# EAGLE schematic megamini-R32 (EAGLE 6.2)
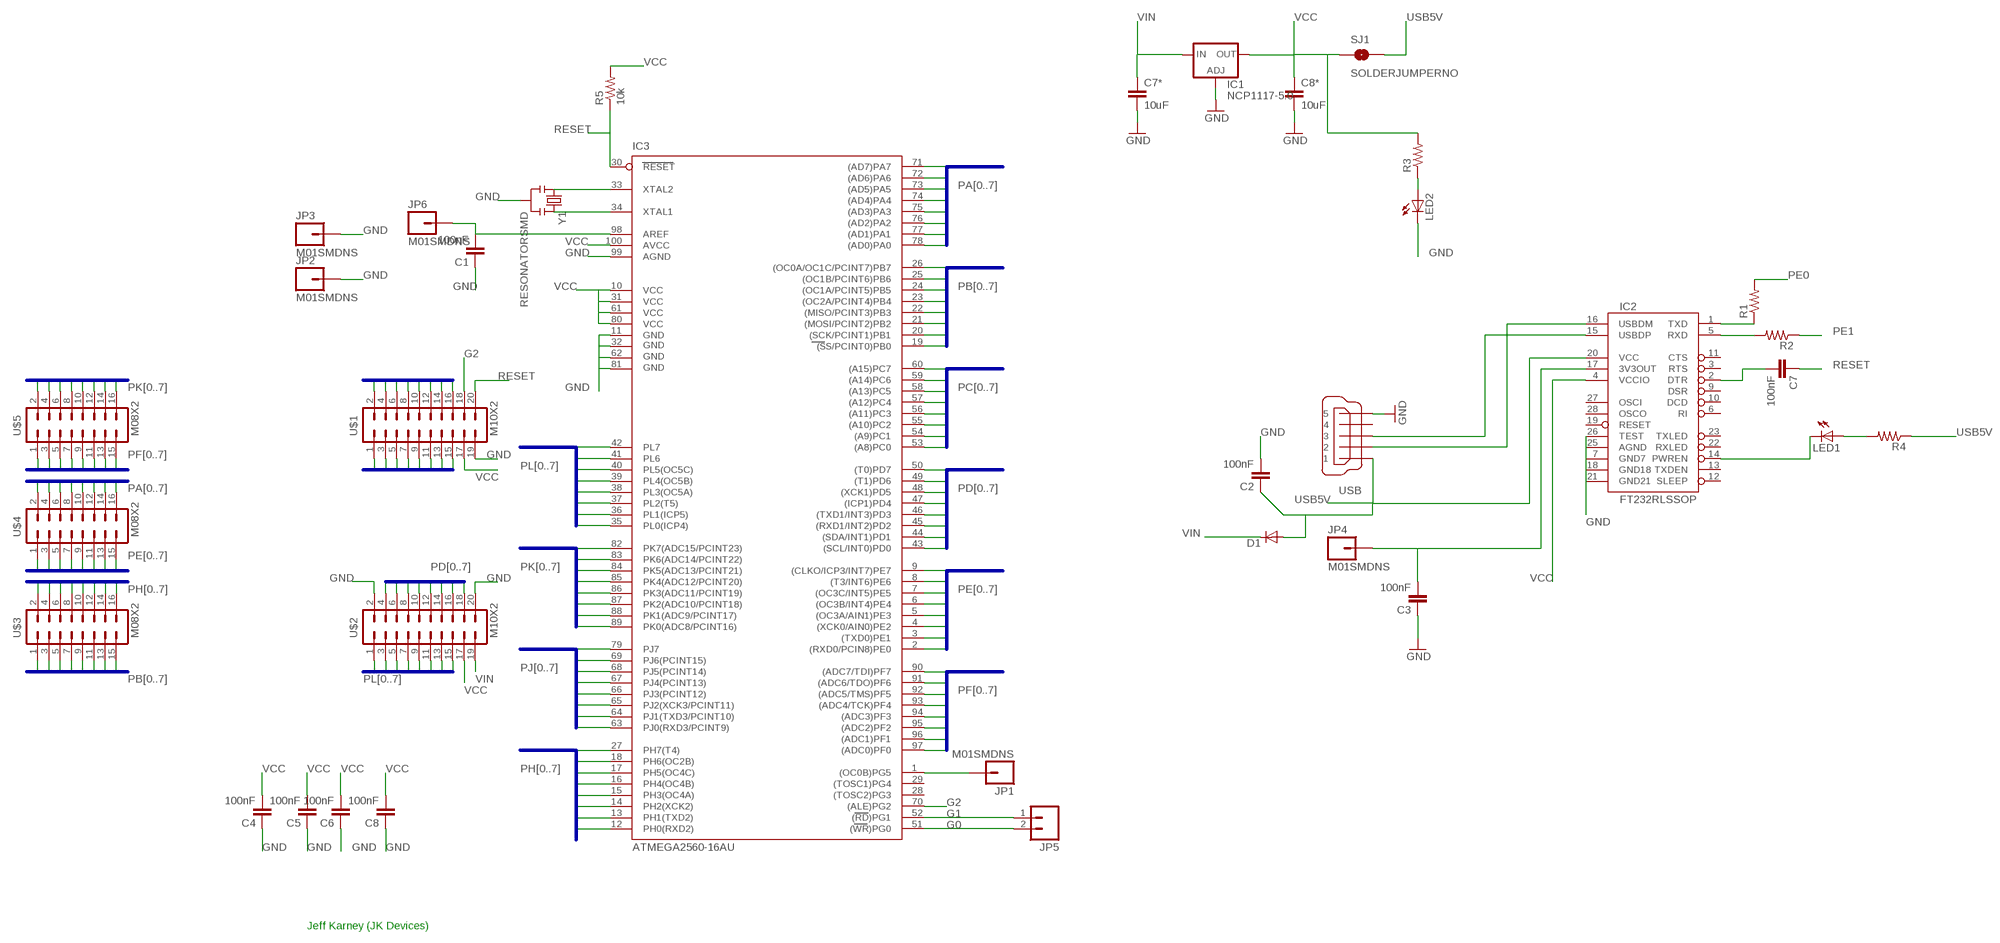
[diagram p0: schematic, sheet 1]

## Parts
C1  100nF  CAP0805  [0805]
C2  100nF  CAP0805  [0805]
C3  100nF  CAP0805  [0805]
C4  100nF  CAP0805  [0805]
C5  100nF  CAP0805  [0805]
C6  100nF  CAP0805  [0805]
C7  100nF  CAP0805  [0805]
C7*  10uF  CAP0805  [0805]
C8  100nF  CAP0805  [0805]
C8*  10uF  CAP0805  [0805]
D1  DIODESOD  [SOD-323]
IC1  NCP1117-5.0  LM317MDT  [DPACK]
IC2  FT232RLSSOP  [SSOP28DB]
IC3  ATMEGA2560-16AU  ATMEGA1280-16AU  [TQFP100]
JP1  M01SMDNS  [1X01NS]
JP2  M01SMDNS  [1X01NS]
JP3  M01SMDNS  [1X01NS]
JP4  M01SMDNS  [1X01NS]
JP5  M02PTH  [1X02]
JP6  M01SMDNS  [1X01NS]
LED1  LED0603  [LED-0603]
LED2  LED0603  [LED-0603]
R1  RESISTOR0805-RES  [0805]
R2  RESISTOR0805-RES  [0805]
R3  RESISTOR0805-RES  [0805]
R4  RESISTOR0805-RES  [0805]
R5  10k  RESISTOR0805-RES  [0805]
SJ1  SOLDERJUMPERNO  [SJ_2S-NO]
U$1  M10X2  [2X10]
U$2  M10X2  [2X10]
U$3  M08X2  [2X8_SMALL]
U$4  M08X2  [2X8_SMALL]
U$5  M08X2  [2X8_SMALL]
USB  MINI-USB-UX60-MB-5ST  [UX60-MB-5ST]
Y1  RESONATORSMD  [RESONATOR-SMD]

## Nets
G0: IC3.51((WR)PG0) JP5.2
G1: IC3.52((RD)PG1) JP5.1
G2: IC3.70((ALE)PG2) U$1.18
GND: C1.1 C2.2 C3.1 C4.1 C5.1 C6.1 C7*.2 C8*.2 C8.1 IC1.1(ADJ) IC2.7(GND7) IC2.18(GND18) IC2.21(GND21) IC2.25(AGND) IC2.26(TEST) IC3.11(GND) IC3.32(GND1) IC3.62(GND2) IC3.81(GND3) IC3.99(AGND) JP2.1 JP3.1 LED2.C U$1.19 U$2.2 U$2.20 USB.5 Y1.2
N$1: IC2.16(USBDM) USB.2
N$2: IC3.1((OC0B)PG5) JP1.1
N$3: IC2.15(USBDP) USB.3
N$4: C7.2 IC2.2(DTR)
N$5: IC2.1(TXD) R1.1
N$6: IC2.5(RXD) R2.2
N$7: C3.2 IC2.17(3V3OUT) JP4.1
N$8: IC3.33(XTAL2) Y1.1
N$9: IC3.34(XTAL1) Y1.3
N$10: LED2.A R3.1
N$11: LED1.A R4.2
N$12: IC2.14(PWREN) LED1.C
N$13: C1.2 IC3.98(AREF) JP6.1
PA0: IC3.78((AD0)PA0) U$4.2
PA1: IC3.77((AD1)PA1) U$4.4
PA2: IC3.76((AD2)PA2) U$4.6
PA3: IC3.75((AD3)PA3) U$4.8
PA4: IC3.74((AD4)PA4) U$4.10
PA5: IC3.73((AD5)PA5) U$4.12
PA6: IC3.72((AD6)PA6) U$4.14
PA7: IC3.71((AD7)PA7) U$4.16
PB0: IC3.19((SS/PCINT0)PB0) U$3.15
PB1: IC3.20((SCK/PCINT1)PB1) U$3.13
PB2: IC3.21((MOSI/PCINT2)PB2) U$3.11
PB3: IC3.22((MISO/PCINT3)PB3) U$3.9
PB4: IC3.23((OC2A/PCINT4)PB4) U$3.7
PB5: IC3.24((OC1A/PCINT5)PB5) U$3.5
PB6: IC3.25((OC1B/PCINT6)PB6) U$3.3
PB7: IC3.26((OC0A/OC1C/PCINT7)PB7) U$3.1
PC0: IC3.53((A8)PC0) U$1.15
PC1: IC3.54((A9)PC1) U$1.13
PC2: IC3.55((A10)PC2) U$1.11
PC3: IC3.56((A11)PC3) U$1.9
PC4: IC3.57((A12)PC4) U$1.7
PC5: IC3.58((A13)PC5) U$1.5
PC6: IC3.59((A14)PC6) U$1.3
PC7: IC3.60((A15)PC7) U$1.1
PD0: IC3.43((SCL/INT0)PD0) U$2.4
PD1: IC3.44((SDA/INT1)PD1) U$2.6
PD2: IC3.45((RXD1/INT2)PD2) U$2.8
PD3: IC3.46((TXD1/INT3)PD3) U$2.10
PD4: IC3.47((ICP1)PD4) U$2.12
PD5: IC3.48((XCK1)PD5) U$2.14
PD6: IC3.49((T1)PD6) U$2.16
PD7: IC3.50((T0)PD7) U$2.18
PE0: IC3.2((RXD0/PCIN8)PE0) R1.2 U$4.15
PE1: IC3.3((TXD0)PE1) R2.1 U$4.13
PE2: IC3.4((XCK0/AIN0)PE2) U$4.11
PE3: IC3.5((OC3A/AIN1)PE3) U$4.9
PE4: IC3.6((OC3B/INT4)PE4) U$4.7
PE5: IC3.7((OC3C/INT5)PE5) U$4.5
PE6: IC3.8((T3/INT6)PE6) U$4.3
PE7: IC3.9((CLKO/ICP3/INT7)PE7) U$4.1
PF0: IC3.97((ADC0)PF0) U$5.15
PF1: IC3.96((ADC1)PF1) U$5.13
PF2: IC3.95((ADC2)PF2) U$5.11
PF3: IC3.94((ADC3)PF3) U$5.9
PF4: IC3.93((ADC4/TCK)PF4) U$5.7
PF5: IC3.92((ADC5/TMS)PF5) U$5.5
PF6: IC3.91((ADC6/TDO)PF6) U$5.3
PF7: IC3.90((ADC7/TDI)PF7) U$5.1
PH0: IC3.12(PH0(RXD2)) U$3.16
PH1: IC3.13(PH1(TXD2)) U$3.14
PH2: IC3.14(PH2(XCK2)) U$3.12
PH3: IC3.15(PH3(OC4A)) U$3.10
PH4: IC3.16(PH4(OC4B)) U$3.8
PH5: IC3.17(PH5(OC4C)) U$3.6
PH6: IC3.18(PH6(OC2B)) U$3.4
PH7: IC3.27(PH7(T4)) U$3.2
PJ0: IC3.63(PJ0(RXD3/PCINT9)) U$1.2
PJ1: IC3.64(PJ1(TXD3/PCINT10)) U$1.4
PJ2: IC3.65(PJ2(XCK3/PCINT11)) U$1.6
PJ3: IC3.66(PJ3(PCINT12)) U$1.8
PJ4: IC3.67(PJ4(PCINT13)) U$1.10
PJ5: IC3.68(PJ5(PCINT14)) U$1.12
PJ6: IC3.69(PJ6(PCINT15)) U$1.14
PJ7: IC3.79(PJ7) U$1.16
PK0: IC3.89(PK0(ADC8/PCINT16)) U$5.16
PK1: IC3.88(PK1(ADC9/PCINT17)) U$5.14
PK2: IC3.87(PK2(ADC10/PCINT18)) U$5.12
PK3: IC3.86(PK3(ADC11/PCINT19)) U$5.10
PK4: IC3.85(PK4(ADC12/PCINT20)) U$5.8
PK5: IC3.84(PK5(ADC13/PCINT21)) U$5.6
PK6: IC3.83(PK6(ADC14/PCINT22)) U$5.4
PK7: IC3.82(PK7(ADC15/PCINT23)) U$5.2
PL0: IC3.35(PL0(ICP4)) U$2.1
PL1: IC3.36(PL1(ICP5)) U$2.3
PL2: IC3.37(PL2(T5)) U$2.5
PL3: IC3.38(PL3(OC5A)) U$2.7
PL4: IC3.39(PL4(OC5B)) U$2.9
PL5: IC3.40(PL5(OC5C)) U$2.11
PL6: IC3.41(PL6) U$2.13
PL7: IC3.42(PL7) U$2.15
RESET: C7.1 IC3.30(RESET) R5.1 U$1.20
USB5V: C2.1 D1.2(A) IC2.20(VCC) R4.1 SJ1.2 USB.1
VCC: C4.2 C5.2 C6.2 C8*.1 C8.2 IC1.4(OUT) IC2.4(VCCIO) IC3.10(VCC) IC3.31(VCC1) IC3.61(VCC2) IC3.80(VCC3) IC3.100(AVCC) R3.2 R5.2 SJ1.1 U$1.17 U$2.17
VIN: C7*.1 D1.1(C) IC1.3(IN) U$2.19
Unconnected: IC2.3(RTS) IC2.6(RI) IC2.9(DSR) IC2.10(DCD) IC2.11(CTS) IC2.12(SLEEP) IC2.13(TXDEN) IC2.19(RESET) IC2.22(RXLED) IC2.23(TXLED) IC2.27(OSCI) IC2.28(OSCO) IC3.28((TOSC2)PG3) IC3.29((TOSC1)PG4) USB.4

## Buses
PB[0..7]
PH[0..7]
PE[0..7]
PA[0..7]
PF[0..7]
PK[0..7]
PL[0..7]
PD[0..7]
PC[0..7]
PJ[0..7]

## Notes on the sheet
- Jeff Karney (JK Devices)

## Library data of the parts
C1-C7 C7* C8 C8* = SparkFun:CAP: Capacitor Standard 0603 ceramic capacitor, and 0.1" leaded capacitor.
D1 = SparkFun:DIODE: Diode These are standard reverse protection diodes and small signal diodes. SMA package can handle up to about 1A. SOD-323 can handle about 200mA. What the SOD-323 package when ordering, there are some mfgs out there that are 5-pin packages.
IC1 = v-reg:LM317?*: 500 mA Adjustable Output Positive Voltage Regulator Source: http://www.onsemi.co.jp .. LM317M-D.PDF
IC2 = SparkFun:FT232RL: USB UART FT232RL 4th Generation USB UART (USB <-> Serial) Controller. Spark Fun Electronics SKU : COM-00650
IC3 = atmel-2005:ATMEGA*: MICROCONTROLLER 64/128/256 Kbytes FLASH 4 Kbytes EEPROM 8 Kbytes SRAM 86 General Purpose I/O pins 12-channels16-bit PWM 4 x Serial USARTs 16-channels 10-bit A/D
JP1-JP4 JP6 = SparkFun:M01: Header 1 Standard 1-pin 0.1" header. Use with straight break away headers (SKU : PRT-00116), right angle break away headers (PRT-00553), swiss pins (PRT-00743), machine pins (PRT-00117), and female headers (PRT-00115).
JP5 = SparkFun:M02: Header 2 Standard 2-pin 0.1" header. Use with straight break away headers (SKU : PRT-00116), right angle break away headers (PRT-00553), swiss pins (PRT-00743), machine pins (PRT-00117), and female headers (PRT-00115). Molex polarized connector foot print use with SKU : PRT-08233 with associated crimp pins and housings.
LED1 LED2 = SparkFun:LED: LEDs Standard schematic elements and footprints for 5mm, 3mm, 1206, and 0603 sized LEDs. 5mm - Spark Fun Electronics SKU : COM-00529 (and others)
R1-R5 = SparkFun:RESISTOR: Resistor Basic schematic elements and footprints for 0603, 1206, and PTH resistors.
SJ1 = SparkFun:SOLDERJUMPER: Solder Jumper Standard SMD solder jumper. Used to automate production. Two varients : Normally Open and Normally Closed are the same, but have different paste layers. NC will have a large amount of paste and should jumper during reflow.
U$1 U$2 = SparkFun:M10X2: This was SPECIALLY designed to be used with our Graphic LCD Backpack. Be sure you want to use this! It is not only staggered on each line of header holes, but IT IS ALSO offset of the center point of the top and bottom lines by 5 mil. This causes the headers to lock into place on the "standard" footprint on the LCD screen. The extra squares on the tdocu layer are there simply to reference other pins (if you were to actually populate a longer header than ten long - this is what we do with the backpacks).
U$3-U$5 = SparkFun:M08X2
USB = con-hirose:MINI-USB-: MINI USB Connector Source: http://www.hirose.co.jp/cataloge_hp/e24000019.pdf; OC_FARNELL: unknown; OC_NEWARK: unknown
Y1 = SparkFun:RESONATOR: Resonator Small SMD resonator. This is the itty bitty 10/20MHz resonators with built in caps. CSTCE10M0G55 and CSTCE20M0V53. Footprint has been reviewed closely but hasn't been tested yet.